# EAGLE design Mini Project Rx (EAGLE 7.4.0)
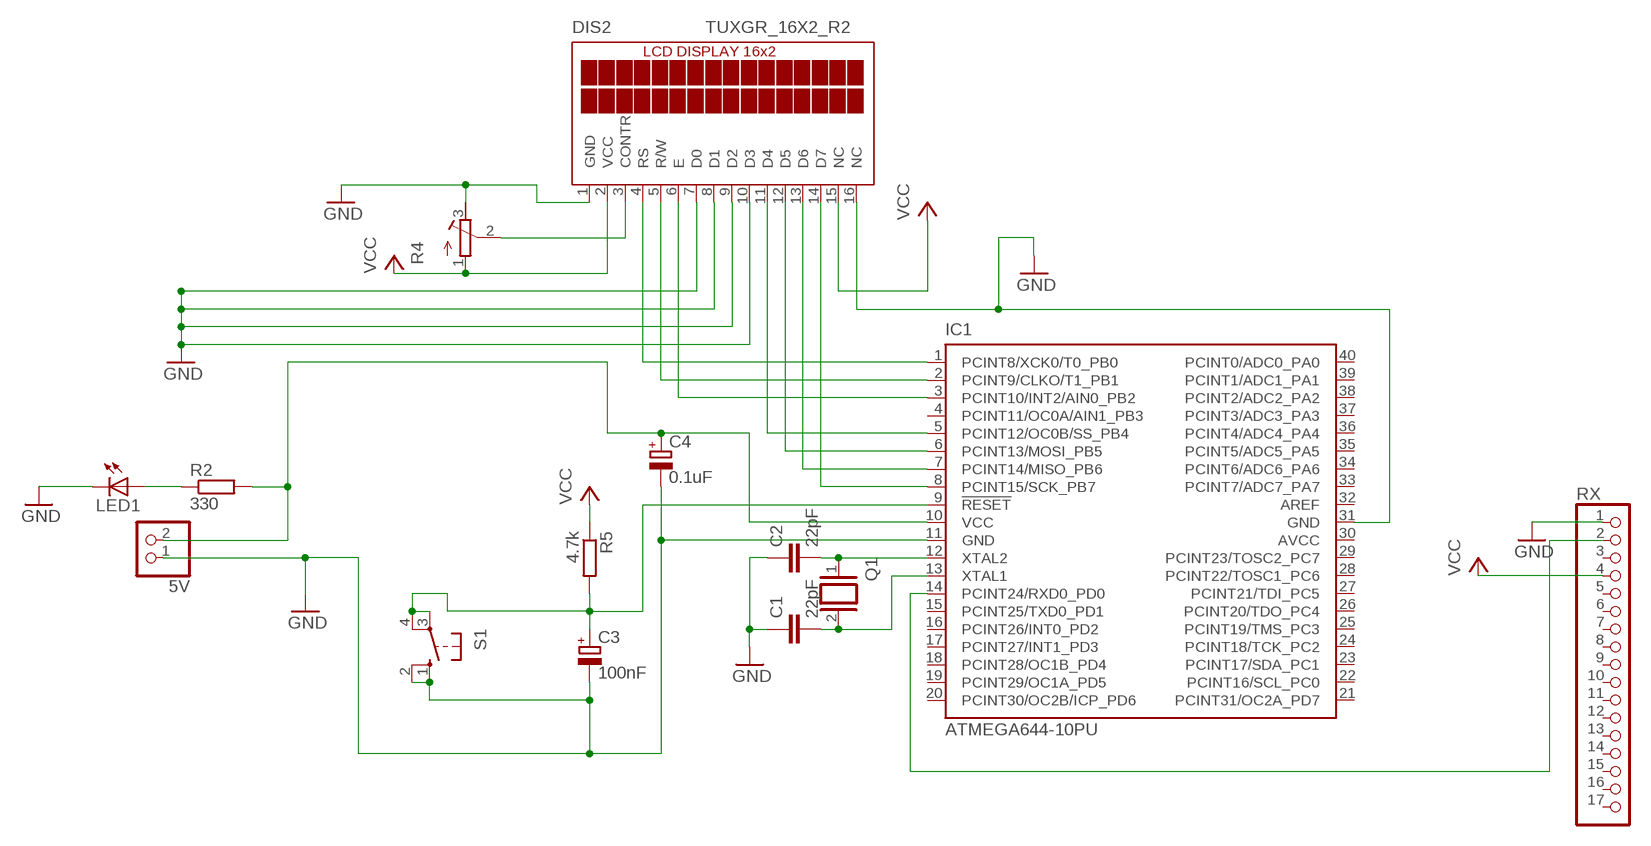
[diagram p0: schematic, sheet 1]

## Parts
5V  PINHD-1X2  [1X02]
C1  22pF  C-EU025-025X050  [C025-025X050]
C2  22pF  C-EU025-025X050  [C025-025X050]
C3  100nF  CPOL-EUE2-4  [E2-4]
C4  0.1uF  CPOL-EUE2-4  [E2-4]
DIS2  TUXGR_16X2_R2  [TUXGR_16X2_R2]
IC1  ATMEGA644-10PU  [DIL40]
LED1  LED5MM  [LED5MM]
Q1  XTAL/S  [QS]
R2  330  R-EU_0207/10  [0207/10]
R4  R-TRIMM64W  [RTRIM64W]
R5  4.7k  R-EU_0207/10  [0207/10]
RX  PINHD-1X17  [1X17]
S1  10-XX  [B3F-10XX]

## Nets
GND: 5V.1 C1.1 C2.1 C3.- C4.- DIS2.1(GND) DIS2.7(D0) DIS2.8(D1) DIS2.9(D2) DIS2.10(D3) DIS2.16(NC) IC1.11(GND) IC1.31(GND) LED1.K(C) R4.3(E) RX.1 S1.1(S) S1.2(S1)
N$1: 5V.2 C4.+ IC1.10(VCC) R2.2
N$2: DIS2.6(E) IC1.3(PCINT10/INT2/AIN0_PB2)
N$3: DIS2.3(CONTR) R4.2(S)
N$4: DIS2.14(D7) IC1.8(PCINT15/SCK_PB7)
N$5: LED1.A R2.1
N$6: DIS2.11(D4) IC1.5(PCINT12/OC0B/SS_PB4)
N$8: DIS2.13(D6) IC1.7(PCINT14/MISO_PB6)
N$9: DIS2.12(D5) IC1.6(PCINT13/MOSI_PB5)
N$12: DIS2.5(R/W) IC1.2(PCINT9/CLKO/T1_PB1)
N$13: DIS2.4(RS) IC1.1(PCINT8/XCK0/T0_PB0)
N$15: C3.+ IC1.9(!RESET) R5.2 S1.3(P) S1.4(P1)
N$17: IC1.14(PCINT24/RXD0_PD0) RX.2
N$18: C2.2 IC1.12(XTAL2) Q1.1
N$19: C1.2 IC1.13(XTAL1) Q1.2
VCC: DIS2.2(VCC) DIS2.15(NC) R4.1(A) R5.1 RX.4
Unconnected: IC1.4(PCINT11/OC0A/AIN1_PB3) IC1.15(PCINT25/TXD0_PD1) IC1.16(PCINT26/INT0_PD2) IC1.17(PCINT27/INT1_PD3) IC1.18(PCINT28/OC1B_PD4) IC1.19(PCINT29/OC1A_PD5) IC1.20(PCINT30/OC2B/ICP_PD6) IC1.21(PCINT31/OC2A_PD7) IC1.22(PCINT16/SCL_PC0) IC1.23(PCINT17/SDA_PC1) IC1.24(PCINT18/TCK_PC2) IC1.25(PCINT19/TMS_PC3) IC1.26(PCINT20/TDO_PC4) IC1.27(PCINT21/TDI_PC5) IC1.28(PCINT22/TOSC1_PC6) IC1.29(PCINT23/TOSC2_PC7) IC1.32(AREF) IC1.33(PCINT7/ADC7_PA7) IC1.34(PCINT6/ADC6_PA6) IC1.35(PCINT5/ADC5_PA5) IC1.36(PCINT4/ADC4_PA4) IC1.37(PCINT3/ADC3_PA3) IC1.38(PCINT2/ADC2_PA2) IC1.39(PCINT1/ADC1_PA1) IC1.40(PCINT0/ADC0_PA0) RX.3 RX.5 RX.6 RX.7 RX.8 RX.9 RX.10 RX.11 RX.12 RX.13 RX.14 RX.15 RX.16 RX.17

## Power pins joined to a net without a drawn wire
AVCC: IC1.30(AVCC)

## Library data of the parts
5V = pinhead:PINHD-1X2: PIN HEADER
C1 C2 = resistor:C-EU: CAPACITOR, European symbol
C3 C4 = resistor:CPOL-EU: POLARIZED CAPACITOR, European symbol
DIS2 = display-lcd:TUXGR_16X2_R2: Tuxgraphics LCD display 16x2 characters reflective, without background light Source: tuxgr_12x2_r2.pdf; OC_FARNELL: unknown; OC_NEWARK: unknown
IC1 = atmel:ATMEGA644-*PU: 8-bit Microcontroller with 64K Bytes In-System Programmable Flash Auto generated by make-symbol-device-package-bsdl.ulp Rev. 34 Source: http://www.atmel.com/dyn/resources/prod_documents/doc2593.pdf; MPN: ATMEGA644V-10PU; OC_FARNELL: 1288342; OC_NEWARK: 23M5062
LED1 = adafruit:LED: LED OSRAM: - CHIPLED LG R971, LG N971, LY N971, LG Q971, LY Q971, LO R971, LY R971 LH N974, LH R974 LS Q976, LO Q976, LY Q976 LO Q996 - Hyper CHIPLED LW Q18S LB Q993, LB Q99A, LB R99A - SideLED LS A670, LO A670, LY A670, LG A670, LP A670 LB A673, LV A673, LT A673, LW A673 LH A674 LY A675 LS A676, LA A676, LO A676, LY A676, LW A676 LS A679, LY A679, LG A679 - Hyper Micro SIDELED® LS Y876, LA Y876, LO Y876, LY Y876 LT Y87S - SmartLED LW L88C, LW L88S LB L89C, LB L89S, LG L890 LS L89K, LO L89K, LY L89K LS L896, LA L896, LO L896, LY L896 - TOPLED LS T670, LO T670, LY T670, LG T670, LP T670 LSG T670, LSP T670, LSY T670, LOP T670, LYG T670 LG T671, LOG T671, LSG T671 LB T673, LV T673, LT T673, LW T673 LH T674 LS T676, LA T676, LO T676, LY T676, LB T676, LH T676, LSB T676, LW T676 LB T67C, LV T67C, LT T67C, LS T67K, LO T67K, LY T67K, LW E67C LS E67B, LA E67B, LO E67B, LY E67B, LB E67C, LV E67C, LT E67C LW T67C LS T679, LY T679, LG T679 LS T770, LO T770, LY T770, LG T770, LP T770 LB T773, LV T773, LT T773, LW T773 LH T774 LS E675, LA E675, LY E675, LS T675 LS T776, LA T776, LO T776, LY T776, LB T776 LHGB T686 LT T68C, LB T68C - Hyper Mini TOPLED® LB M676 - Mini TOPLED Santana® LG M470 LS M47K, LO M47K, LY M47K Source: http://www.osram.convergy.de/
Q1 = special:XTAL/S: CRYSTAL
R2 R5 = resistor:R-EU_: RESISTOR, European symbol
R4 = resistor:R-TRIMM: Trimm resistor
RX = pinhead:PINHD-1X17: PIN HEADER
S1 = switch-omron:10-XX: OMRON SWITCH; MPN: B3F-1000; OC_FARNELL: 176432; OC_NEWARK: 36M3542

## Board
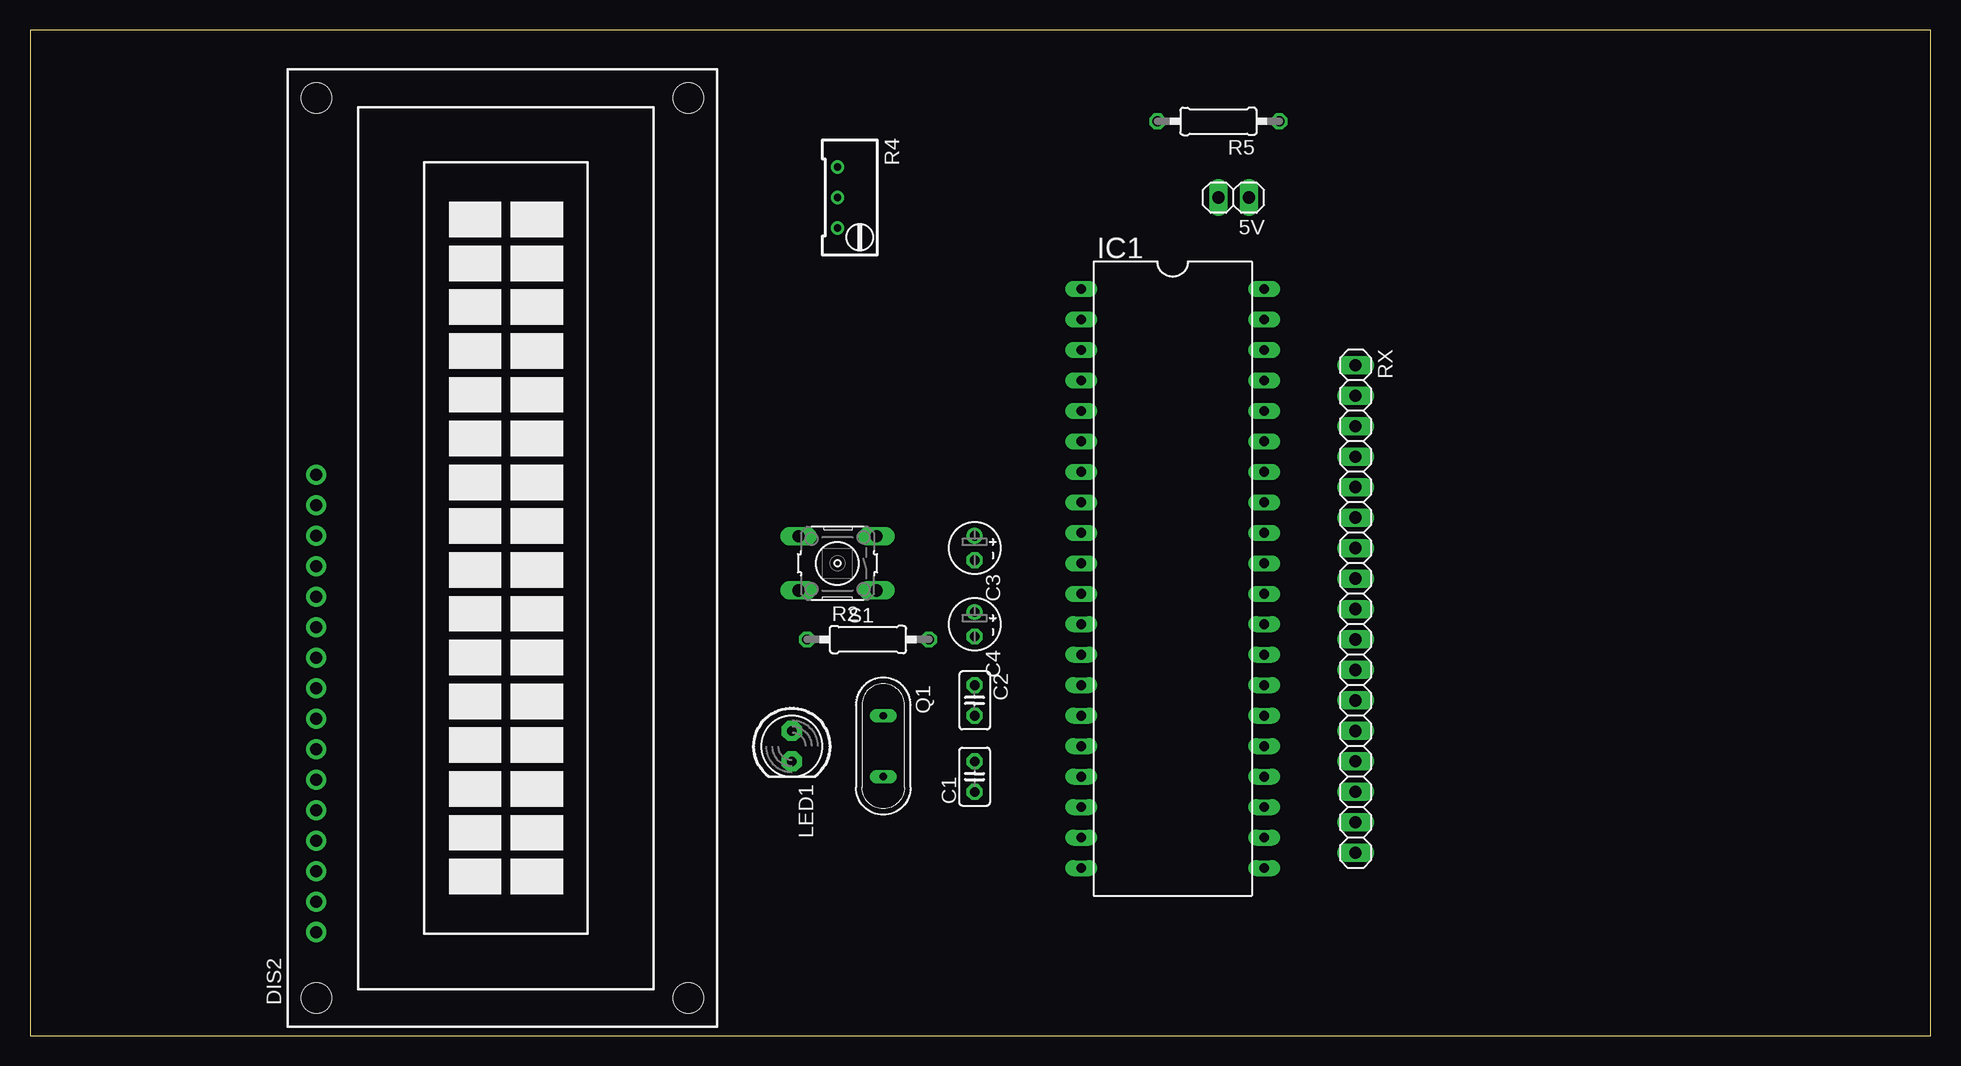
[diagram p1: board, top side]
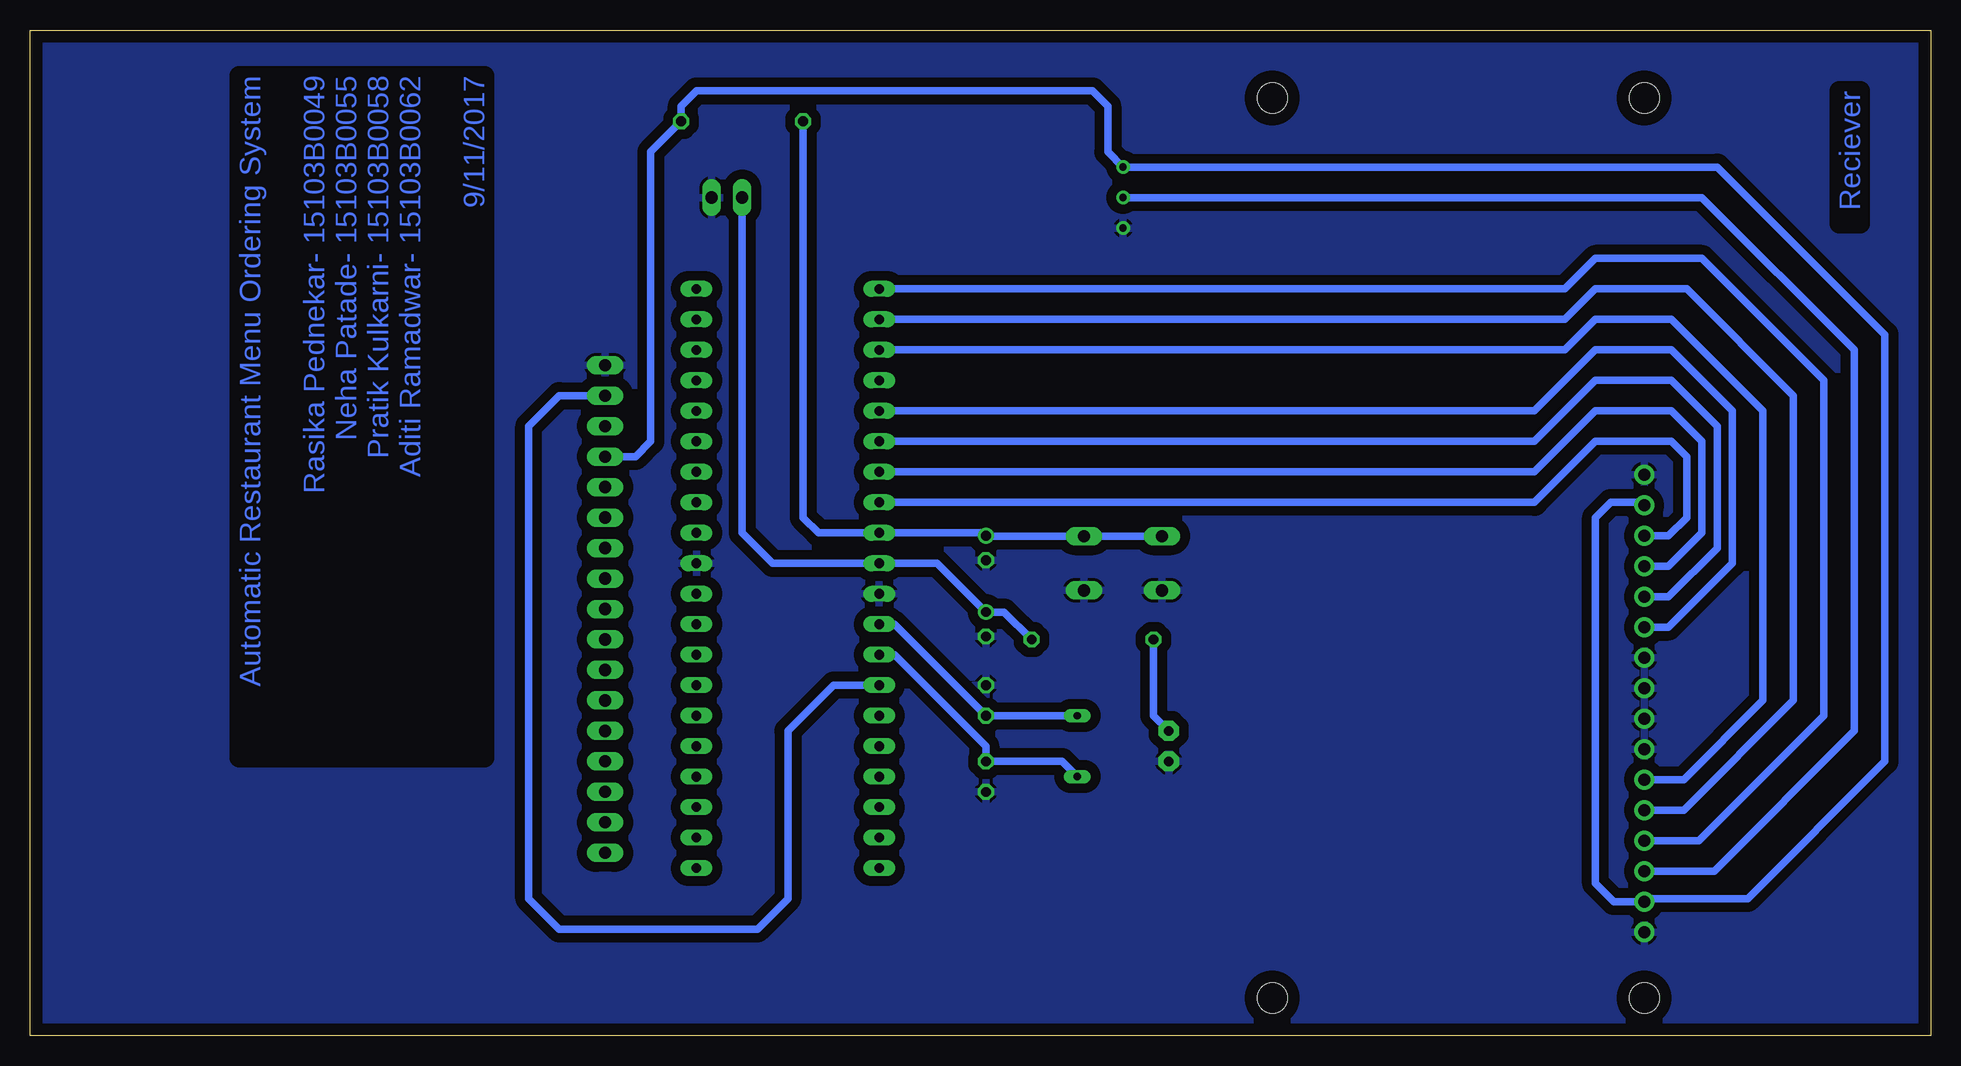
[diagram p2: board, bottom side, seen from below]

Size 158.42 x 83.81 mm. Coordinates in mm from the lower left corner, seen from the top.
Outline: 0,0 158.42,0 158.42,83.81 0,83.81 0,0
Copper layers (1*16): Top 0.035mm / dielectric 1.5mm / Bottom 0.035mm
Design rules "default": minimum track width 10mil, minimum drill 24mil, track to track 8mil, track to pad 8mil, pad to pad 8mil, via to via 8mil, smd to smd 8mil, copper to edge 40mil, drill to drill 8mil, minimum pad ring 10mil, minimum via ring 8mil, stop-mask expansion 4mil, vias tented up to drill 0mil, thermal gap 10mil

### Footprints (pad centres in the part's own frame; a part is rotated, then mirrored left to right if it is on the bottom)
1X02 = drill 1.016 long: 1 -1.27,0; 2 1.27,0
C025-025X050 = drill 0.813 octagon: 1 -1.27,0; 2 1.27,0
E2-4 = drill 0.813 pad 1.27: + -1.016,0 | drill 0.813 pad 1.27 octagon: - 1.016,0
TUXGR_16X2_R2 = drill 1 pad 1.676: 1 -32,15.5; 2 -29.46,15.5; 3 -26.92,15.5; 4 -24.38,15.5; 5 -21.84,15.5; 6 -19.3,15.5; 7 -16.76,15.5; 8 -14.22,15.5; 9 -11.68,15.5; 10 -9.14,15.5; 11 -6.6,15.5; 12 -4.06,15.5; 13 -1.52,15.5; 14 1.02,15.5; 15 3.56,15.5; 16 6.1,15.5 | hole 2.5: -37.5,-15.5; 37.5,-15.5; -37.5,15.5; 37.5,15.5
DIL40 = drill 0.813 long: 1 -24.13,-7.62; 2 -21.59,-7.62; 3 -19.05,-7.62; 4 -16.51,-7.62; 5 -13.97,-7.62; 6 -11.43,-7.62; 7 -8.89,-7.62; 8 -6.35,-7.62; 9 -3.81,-7.62; 10 -1.27,-7.62; 11 1.27,-7.62; 12 3.81,-7.62; 13 6.35,-7.62; 14 8.89,-7.62; 15 11.43,-7.62; 16 13.97,-7.62; 17 16.51,-7.62; 18 19.05,-7.62; 19 21.59,-7.62; 20 24.13,-7.62; 21 24.13,7.62; 22 21.59,7.62; 23 19.05,7.62; 24 16.51,7.62; 25 13.97,7.62; 26 11.43,7.62; 27 8.89,7.62; 28 6.35,7.62; 29 3.81,7.62; 30 1.27,7.62; 31 -1.27,7.62; 32 -3.81,7.62; 33 -6.35,7.62; 34 -8.89,7.62; 35 -11.43,7.62; 36 -13.97,7.62; 37 -16.51,7.62; 38 -19.05,7.62; 39 -21.59,7.62; 40 -24.13,7.62
LED5MM = drill 0.813 pad 1.676 octagon: A -1.27,0; K 1.27,0
QS = drill 0.61 long: 1 -2.54,0; 2 2.54,0
0207/10 = drill 0.813 octagon: 1 -5.08,0; 2 5.08,0
RTRIM64W = drill 0.61: 1 1.27,-2.54; 2 1.27,0; 3 1.27,2.54
1X17 = drill 1.016 long: 1 -20.32,0; 2 -17.78,0; 3 -15.24,0; 4 -12.7,0; 5 -10.16,0; 6 -7.62,0; 7 -5.08,0; 8 -2.54,0; 9 0,0; 10 2.54,0; 11 5.08,0; 12 7.62,0; 13 10.16,0; 14 12.7,0; 15 15.24,0; 16 17.78,0; 17 20.32,0
B3F-10XX = drill 1.016 long: 1 -3.251,2.261; 2 3.251,2.261; 3 -3.251,-2.261; 4 3.251,-2.261

### Placement (x,y rotation side)
5V  100.33,69.85 180 top
C1  78.74,21.59 90 top
C2  78.74,27.94 270 top
C3  78.74,40.64 270 top
C4  78.74,34.29 270 top
DIS2  39.37,40.64 90 top
IC1  95.25,38.1 270 top
LED1  63.5,24.13 270 top
Q1  71.12,24.13 270 top
R2  69.85,33.02 0 top
R4  68.58,69.85 180 top
R5  99.06,76.2 180 top
RX  110.49,35.56 270 top
S1  67.31,39.37 180 top

### Tracks (layer width: path | path; a pad name or v marks a point on that pad's centre or on a via)
GND
  pour Bottom (isolate 0.813): 0,83.82 158.75,83.82 158.75,0 0,0
N$1
  Bottom 0.61: R2.2 77.22,35.31 C4.+ 82.8,39.37 IC1.10 96.52,39.37 99.06,41.91 5V.2
N$2
  Bottom 0.61: DIS2.6 20.57,21.34 13.97,27.94 13.97,52.07 21.59,59.69 27.94,59.69 30.48,57.15 IC1.3
N$3
  Bottom 0.61: DIS2.3 18.03,13.72 6.35,25.4 6.35,57.15 19.05,69.85 R4.2
N$4
  Bottom 0.61: DIS2.14 21.84,41.66 20.32,43.18 20.32,48.26 21.59,49.53 27.94,49.53 33.02,44.45 IC1.8
N$5
  Bottom 0.61: R2.1 64.77,26.67 LED1.A
N$6
  Bottom 0.61: DIS2.11 21.84,34.04 16.51,39.37 16.51,52.07 21.59,57.15 27.94,57.15 33.02,52.07 IC1.5
N$8
  Bottom 0.61: DIS2.13 21.84,39.12 19.05,41.91 19.05,49.53 21.59,52.07 27.94,52.07 33.02,46.99 IC1.7
N$9
  Bottom 0.61: DIS2.12 21.84,36.58 17.78,40.64 17.78,50.8 21.59,54.61 27.94,54.61 33.02,49.53 IC1.6
N$12
  Bottom 0.61: DIS2.5 20.57,18.8 11.43,27.94 11.43,53.34 20.32,62.23 27.94,62.23 30.48,59.69 IC1.2
N$13
  Bottom 0.61: DIS2.4 19.3,16.26 8.89,26.67 8.89,54.61 19.05,64.77 27.94,64.77 30.48,62.23 IC1.1
N$15
  Bottom 0.61: S1.4 S1.3 78.72,41.63 C3.+ 78.99,41.91 IC1.9 92.71,41.91 93.98,43.18 R5.2
N$17
  Bottom 0.61: IC1.14 91.44,29.21 95.25,25.4 95.25,11.43 97.79,8.89 114.3,8.89 116.84,11.43 116.84,50.8 114.3,53.34 RX.2
N$18
  Bottom 0.61: IC1.12 86.36,34.29 C2.2 Q1.1
N$19
  Bottom 0.61: IC1.13 86.36,31.75 78.74,24.13 C1.2 72.39,22.86 Q1.2
VCC
  Bottom 0.61: DIS2.15 24.12,44.45 26.67,44.45 27.94,43.18 27.94,12.7 26.42,11.18 DIS2.2 23.62,11.43 15.24,11.43 3.81,22.86 3.81,58.42 17.78,72.39 R4.1 68.58,73.66 68.58,77.47 69.85,78.74 102.87,78.74 104.14,77.47 R5.1 106.68,73.66 106.68,49.53 107.95,48.26 RX.4

### Text on the board
Bottom: Automatic Restaurant Menu Ordering System / / Rasika Pednekar- 15103B0049 / Neha Patade- 15103B0055 / Pratik Kulkarni- 15103B0058 / Aditi Ramadwar- 15103B0062 / / 9/11/2017 | Reciever